# Altium schematic sheet Sheet2.SchDoc: Extension PSoC
size A4; DrawnBy: M. Osée; Organization: ULB - BEAMS; Address1: 50, Av. F. D. Roosevelt; Address2: CP165/56; Address3: 1050 Bruxelles; Revision: B; SheetNumber: 2; SheetTotal: 2
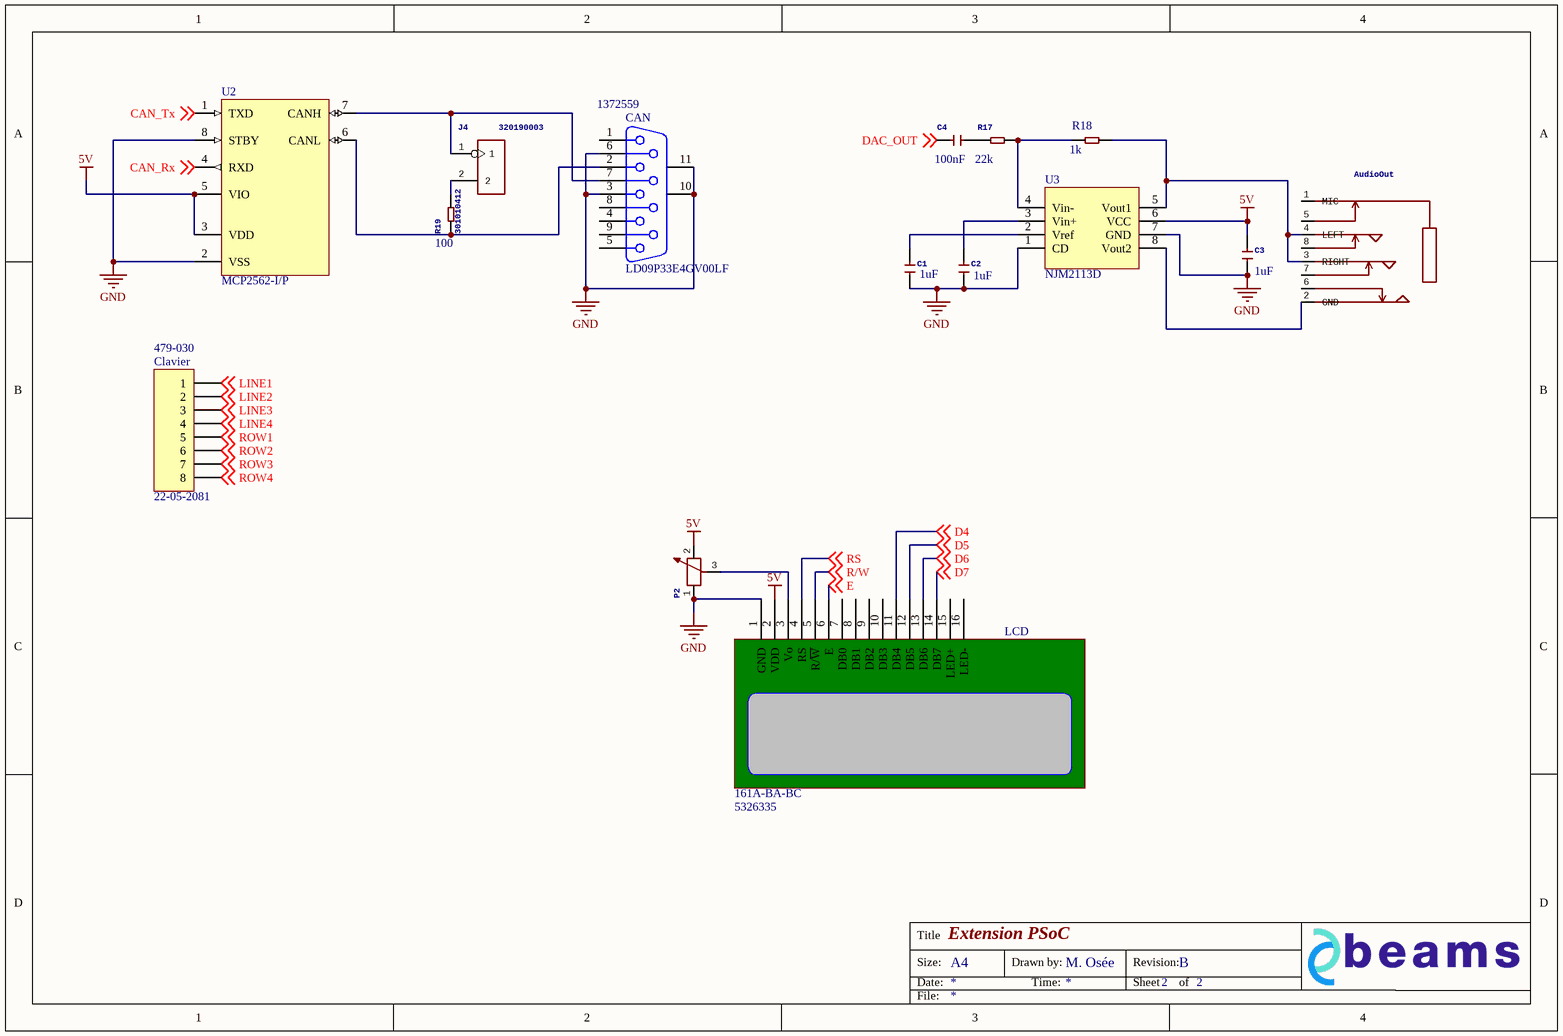
[diagram p0: Sheet2.SchDoc]

## Parts
AudioOut  320040003  [AUDIO8P-SMD-3.5-14.5X6X5MM]  (value not drawn)
C1  value 1uF  [C0805]  (hidden comment: 302010179)
C2  value 1uF  [C0805]  (hidden comment: 302010179)
C3  value 1uF  [C0805]  (hidden comment: 302010179)
C4  value 100nF  [C0603]  (hidden comment: 302010138)
CAN  LD09P33E4GV00LF  Supplier Part Number 1: 1372559  [DSUB1.385-2H9B]
Clavier  22-05-2081  Supplier Part Number 1: 479-030  [HDR1X8H]
J4  320190003  [H2-2.54]
LCD  161A-BA-BC  Supplier Part Number 1: 5326335  [PC161A]
P2  301040007  [ADJR3-9.5X9.5X10.5MM]  (value not drawn)
R17  value 22k  [R0603]  (hidden comment: 301010132)
R18  value 1k  [R0603]  (hidden comment: 301010298)
R19  301010412  value 100  [R1206]
U2  MCP2562-I/P  [DIP8]
U3  NJM2113D  [DIP8]

## Nets
5V: C3.2 LCD.2(VDD) P2.2 U2.3(VDD) U2.5(VIO) U3.6(VCC)
GND: C1.1 C2.1 C3.1 CAN.3 CAN.6 CAN.10(MH1) CAN.11(MH2) LCD.1(GND) P2.1 U2.2(VSS) U2.8(STBY) U3.1(CD) U3.7(GND)
CAN_Rx: U2.4(RXD) ; off-sheet CAN_Rx
CAN_Tx: U2.1(TXD) ; off-sheet CAN_Tx
D4: LCD.11(DB4) ; off-sheet D4
D5: LCD.12(DB5) ; off-sheet D5
D6: LCD.13(DB6) ; off-sheet D6
D7: LCD.14(DB7) ; off-sheet D7
DAC_OUT: C4.1 ; off-sheet DAC_OUT
E: LCD.6(E) ; off-sheet E
LINE1: Clavier.1 ; off-sheet LINE1
LINE2: Clavier.2 ; off-sheet LINE2
LINE3: Clavier.3 ; off-sheet LINE3
LINE4: Clavier.4 ; off-sheet LINE4
R/W: LCD.5(R/~{W}) ; off-sheet R/W
ROW1: Clavier.5 ; off-sheet ROW1
ROW2: Clavier.6 ; off-sheet ROW2
ROW3: Clavier.7 ; off-sheet ROW3
ROW4: Clavier.8 ; off-sheet ROW4
RS: LCD.4(RS) ; off-sheet RS
NetAudioOut_2: AudioOut.2(GND) U3.8(Vout2)
NetAudioOut_3: AudioOut.3(RIGHT) AudioOut.4(LEFT) R18.2 U3.5(Vout1)
NetC1_2: C1.2 U3.2(Vref)
NetC2_2: C2.2 U3.3(Vin+)
NetC4_2: C4.2 R17.1
NetCAN_2: CAN.2 R19.1 U2.6(CANL)
NetCAN_7: CAN.7 J4.1 U2.7(CANH)
NetJ4_2: J4.2 R19.2
NetLCD_3: LCD.3(Vo) P2.3
NetR17_2: R17.2 R18.1 U3.4(Vin-)

Not connected (* = marked no-connect by the designer): AudioOut 1(MIC) 5 6 7 8; CAN 1 4 5 8 9; LCD 7(DB0) 8(DB1) 9(DB2) 10(DB3) 15(LED+) 16(LED-)

## Notes on the sheet
- Title
- Size:
- Date:
- A4
- Drawn by:
- Time:
- Revision:
- Sheet
- of
- File:

## Library data of the parts
AudioOut = AUDIO-JACK-SMD-8P(PJ-3536-L6S): MPN: PJ-3536-L6S
C1-C3 = CERAMIC-1UF-25V-10%-X7R(0805): MPN: CC0805KKX7R8BB105
C4 = CERAMIC-100NF-50V-10%-X7R(0603): MPN: CC0603KRX7R9BB104
CAN = D Connector 9: Receptacle Assembly, 9 Position, Right Angle; PackageDocument: O; Positions: 9; Published: 15-Jun-2001; LatestRevisionDate: 17-Jul-2002; LatestRevisionNote: Re-released for DXP Platform.; DatasheetDocument: 1-Sep-1999; PackageReference: 788750; Publisher: Altium Limited; Orientation: Right Angle; Gender: Receptacle; Supplier 1: RSComponents
Clavier = Header 8H: Header, 8-Pin, Right Angle; LatestRevisionDate: 17-Jul-2002; LatestRevisionNote: Re-released for DXP Platform.; Publisher: Altium Limited; Supplier 1: RSComponents
J4 = DIP-BLACK-JUMPER
LCD = PC161A: Displaytech 16x1 LCD monochrome display; Supplier 1: RSComponents
P2 = DIP-VR-TOP-ADJ-10K(3P-9.5X9.5X5MM): MPN: 3386U-103
R17 = SMD-RES-22K-5%-1/10W(0603): MPN: RC0603JR-0722KL
R18 = SMD-RES-1K-1%-1/10W(0603): MPN: RC0603FR-071KL
R19 = SMD-RES-100R-5%-1/4W(1206): MPN: RC1206JR-07100RL
U2 = MCP2562-I/P: High-Speed CAN Transceiver, 8-Pin PDIP; Manufacturer: Microchip; PartNumber: MCP2551-I/P; DatasheetVersion: revF, Jul-2010; PackageVersion: revBB, Aug-2009; PackageReference: PDIP300-P8; PackageDescription: 8-Lead Plastic Dual In-Line (P) - 300 mil Body [PDIP]; Supplier 1: Digi-Key; Supplier Part Number 1: MCP2551-I/P-ND; Supplier 2: Farnell; Supplier Part Number 2: 1292240; Supplier 3: Newark; Supplier Part Number 3: 61K2947; Supplier 4: Mouser; Supplier Part Number 4: 579-MCP2551-I/P; Mounting Technology: Through Hole; Code_JEDEC: MS-001; ComponentLink1Description: Manufacturer URL; ComponentLink1URL: http://www.microchip.com/; ComponentLink2Description: Datasheet; ComponentLink2URL: http://ww1.microchip.com/downloads/en/DeviceDoc/21667F.pdf; ComponentLink3Description: Package Specification; ComponentLink3URL: http://www.microchip.com/stellent/groups/techpub_sg/documents/packagingspec/en012702.pdf